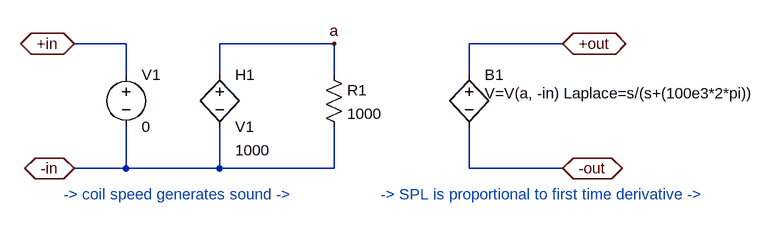
[diagram p0: schematic Differentiator.asc]
Differentiator.asc, the LTspice schematic file:
Version 4
SHEET 1 1124 680
WIRE -80 -48 -160 -48
WIRE 240 -48 64 -48
WIRE 592 -48 448 -48
WIRE -80 0 -80 -48
WIRE 64 0 64 -48
WIRE 240 0 240 -48
WIRE 448 0 448 -48
WIRE -80 144 -80 80
WIRE -80 144 -160 144
WIRE 64 144 64 80
WIRE 64 144 -80 144
WIRE 240 144 240 80
WIRE 240 144 64 144
WIRE 448 144 448 80
WIRE 592 144 448 144
FLAG -160 -48 +in
IOPIN -160 -48 BiDir
FLAG -160 144 -in
IOPIN -160 144 BiDir
FLAG 592 -48 +out
IOPIN 592 -48 BiDir
FLAG 592 144 -out
IOPIN 592 144 BiDir
FLAG 240 -48 a
SYMBOL h 64 -16 R0
WINDOW 123 24 132 Left 0
SYMATTR Value2 1000
SYMATTR InstName H1
SYMATTR Value V1
SYMBOL voltage -80 -16 R0
WINDOW 123 0 0 Left 0
WINDOW 39 0 0 Left 0
SYMATTR InstName V1
SYMATTR Value 0
SYMBOL bv 448 -16 R0
WINDOW 3 24 44 Left 0
SYMATTR Value V=V(a, -in) Laplace=s/(s+(100e3*2*pi))
SYMATTR InstName B1
SYMBOL res 224 -16 R0
SYMATTR InstName R1
SYMATTR Value 1000
TEXT -176 184 Left 0 ;-> coil speed generates sound ->
TEXT 312 184 Left 0 ;-> SPL is proportional to first time derivative ->

The netlist it stands for:
* Differentiator.asc
H1 a -in V1 1000
V1 +in -in 0
B1 +out -out V=V(a, -in) Laplace=s/(s+(100e3*2*pi))
R1 a -in 1000
* -> coil speed generates sound ->
* -> SPL is proportional to first time derivative ->
.backanno
.end